# Altium schematic sheet Slave.SchDoc: Slave_subcircuit
size A4; DrawnBy: A.F
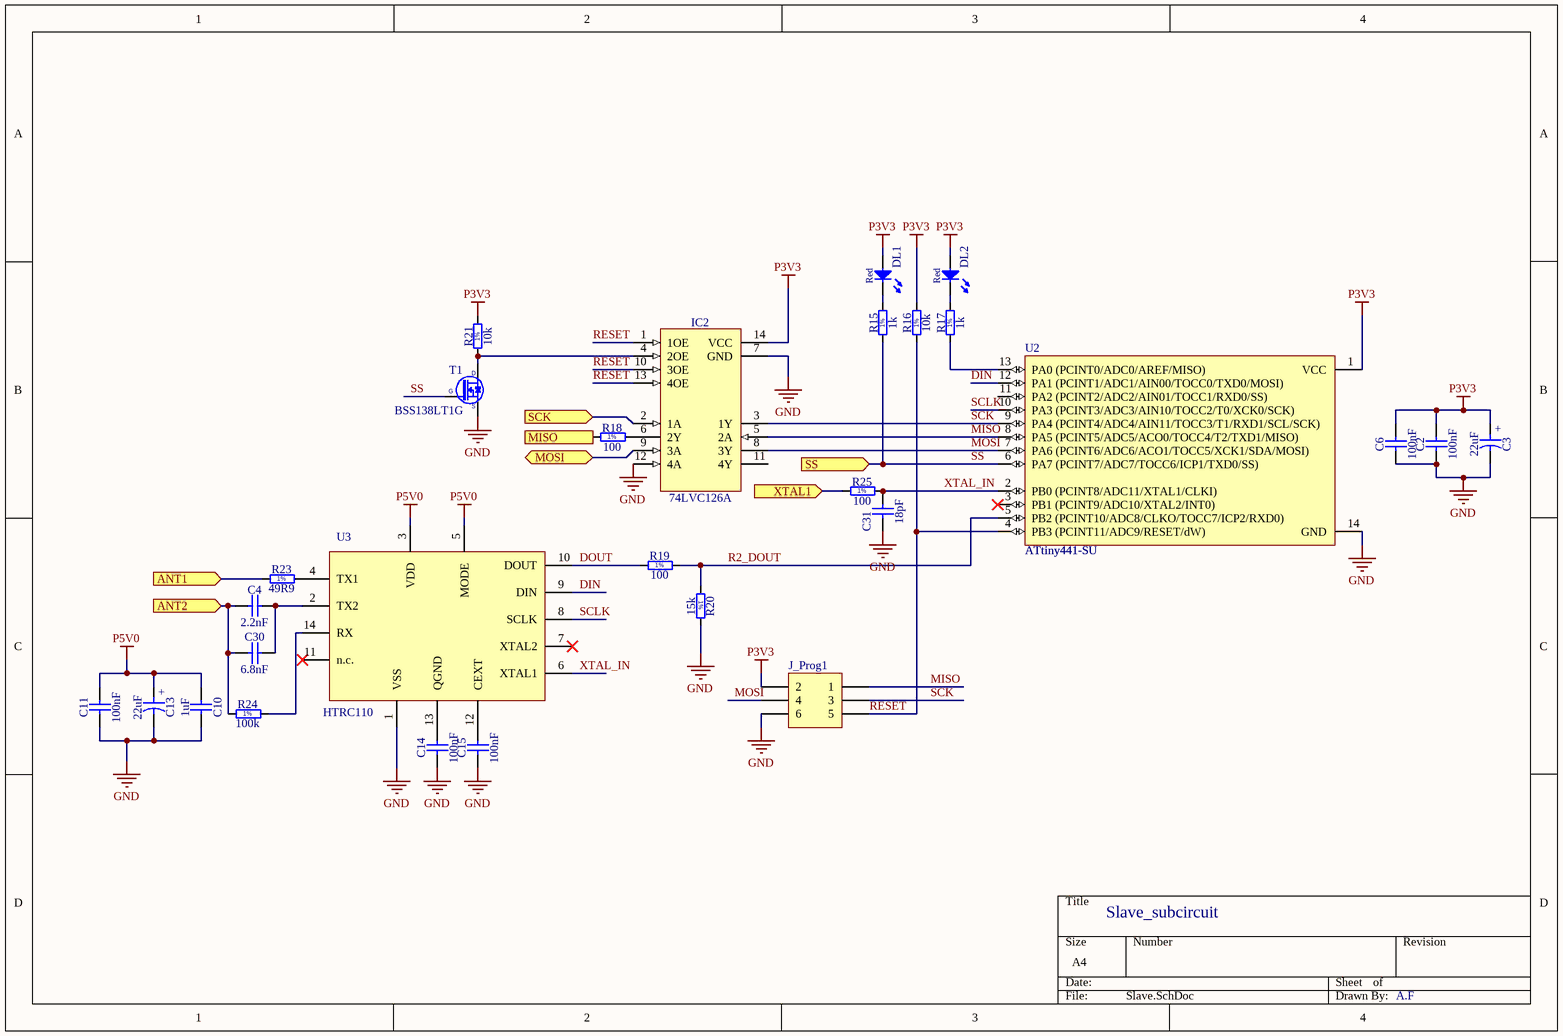
[diagram p0: Slave.SchDoc]

## Parts
C2  100nF  [CAPC1608X87N]
C3  22uF  [CAPAE430X540N]
C4  2.2nF  [CAPC1005X55N]
C6  100nF  [CAPC1608X87N]
C10  1uF  [CAPC1005X55N]
C11  100nF  [CAPC1608X87N]
C13  22uF  [CAPAE430X540N]
C14  100nF  [CAPC1608X87N]
C15  100nF  [CAPC1608X87N]
C30  6.8nF  [CAPC1005X55N]
C31  18pF  [CAPC1005X55N]
DL1  Red  [LED_OSRAM_LSR976]
DL2  Red  [LED_OSRAM_LSR976]
IC2  74LVC126A  [SOIC127P600X175-14N]
J_Prog1  (no value)  [HDR2X3]
R15  1k  [RESC1608X50N]
R16  10k  [RESC1608X50N]
R17  1k  [RESC1608X50N]
R18  100  [RESC1005X40N]
R19  100  [RESC1005X40N]
R20  15k  [RESC1608X50N]
R21  10k  [RESC1608X50N]
R23  49R9  [RESC6331X70N]
R24  100k  [RESC1005X40N]
R25  100  [RESC1005X40N]
T1  BSS138LT1G  [SOT95P240X110-3N]
U2  ATtiny441-SU  [14S1_L]
U3  HTRC110  [SOIC127P600X175-14N]

## Ports
ANT1 (in), ANT2 (in), MISO (out), MOSI (bidir), SCK (in), SS (in), XTAL1 (in)

## Nets
GND: C2.1 C3.2 C6.1 C10.2 C11.1 C13.2 C14.1 C15.1 C31.1 IC2.7(GND) IC2.12(4A) J_Prog1.6 R20.2 T1.2(S) U2.14(GND) U3.1(VSS)
P3V3: C2.2 C3.1 C6.2 DL1.2(A) DL2.2(A) IC2.14(VCC) J_Prog1.2 R16.2 R21.2 U2.1(VCC)
P5V0: C10.1 C11.2 C13.1 U3.3(VDD) U3.5(MODE)
ANT1: R23.1 ; port ANT1
ANT2: C4.1 C30.1 R24.1 ; port ANT2
DIN: U2.12(PA1_(PCINT1/ADC1/AIN00/TOCC0/TXD0/MOSI)) U3.9(DIN)
DOUT: R19.1 U3.10(DOUT)
MISO: IC2.5(2A) J_Prog1.1 U2.8(PA5_(PCINT5/ADC5/ACO0/TOCC4/T2/TXD1/MISO))
MISO: R18.1 ; port MISO  [a separate net that carries the same name]
MOSI: IC2.8(3Y) J_Prog1.4 U2.7(PA6_(PCINT6/ADC6/ACO1/TOCC5/XCK1/SDA/MOSI))
MOSI: IC2.9(3A) ; port MOSI  [a separate net that carries the same name]
R2_DOUT: R19.2 R20.1 U2.5(PB2_(PCINT10/ADC8/CLKO/TOCC7/ICP2/RXD0))
RESET: IC2.1(1OE) IC2.10(3OE) IC2.13(4OE) J_Prog1.5 R16.1 U2.4(PB3_(PCINT11/ADC9/RESET/dW))
SCK: IC2.3(1Y) J_Prog1.3 U2.9(PA4_(PCINT4/ADC4/AIN11/TOCC3/T1/RXD1/SCL/SCK))
SCK: IC2.2(1A) ; port SCK  [a separate net that carries the same name]
SCLK: U2.10(PA3_(PCINT3/ADC3/AIN10/TOCC2/T0/XCK0/SCK)) U3.8(SCLK)
SS: R15.1 T1.1(G) U2.6(PA7_(PCINT7/ADC7/TOCC6/ICP1/TXD0/SS)) ; port SS
XTAL1: R25.1 ; port XTAL1
XTAL_IN: C31.2 R25.2 U2.2(PB0_(PCINT8/ADC11/XTAL1/CLKI)) U3.6(XTAL1)
NetC4_2: C4.2 C30.2 U3.2(TX2)
NetC14_2: C14.2 U3.13(QGND)
NetC15_2: C15.2 U3.12(CEXT)
NetDL1_1: DL1.1(C) R15.2
NetDL2_1: DL2.1(C) R17.2
NetIC2_4: IC2.4(2OE) R21.1 T1.3(D)
NetIC2_6: IC2.6(2Y) R18.2
NetR17_1: R17.1 U2.13(PA0_(PCINT0/ADC0/AREF/MISO))
NetR23_2: R23.2 U3.4(TX1)
NetR24_2: R24.2 U3.14(RX)

Not connected (* = marked no-connect by the designer): IC2 11(4Y); U2 3(PB1_(PCINT9/ADC10/XTAL2/INT0))* 11(PA2_(PCINT2/ADC2/AIN01/TOCC1/RXD0/SS)); U3 7(XTAL2)* 11(n.c.)*

## Notes on the sheet
- (in symbol CAE430-540_22UF_10V_20%) +
- (in symbol R0402_100K_1%_0.0625W_100PPM) 1%
- (in symbol R0402_100R_1%_0.0625W_100PPM) 1%
- (in symbol R0603_10K_1%_0.1W_100PPM) 1%
- (in symbol R0603_15K_1%_0.1W_100PPM) 1%
- (in symbol R0805_1K_1%_0.33W_100PPM_VISHAY_CRCW-HP) 1%
- (in symbol R2512_49R9_1%_1W_100PPM_VISHAY_CRCW) 1%

## Library data of the parts
C2 C6 C14 C15 = CC0603_100NF_50V_10%_X5R: Non-polarised capacitor; Part Description: SMD Multilayer Chip Ceramic Capacitor; Manufacturer: GENERIC; Manufacturer1 Part Number: C1608X5R1H104K080AA; Voltage: 50V; TC: X5R; Tolerance: ±10%; Part Number: CC0603_100NF_50V_10%_X5R; Component Kind: Standard; Component Type: Standard; Pin Count: 2; Value: 100nF; Status: None; Manufacturer Part Number: CC0603_100NF_50V_10%_X5R; Case: 0603; Mounted: Yes; Socket: No; SMD: Yes; Sense: No; Manufacturer1 Example: TDK; Manufacturer1 ComponentHeight: 0.9mm; HelpURL: \\cern.ch\dfs\Applications\Altium\Datasheets\CC0603_X5R_TDK_C.pdf; Author: CERN DEM MR; CreateDate: 08.01.2016; LatestRevisionDate: 08.01.2016
C3 C13 = CAE430-540_22UF_10V_20%: Polarised capacitor; Part Description: Aluminum Electrolytic SMT Capacitor; Manufacturer: PANASONIC; Manufacturer Part Number: EEEFK1A220AR; Voltage: 10V; Tolerance: ±20%; Part Number: CAE430-540_22UF_10V_20%; Component Kind: Standard; Component Type: Standard; Pin Count: 2; Value: 22uF; Status: Not Recommended; Case: B; Mounted: Yes; Socket: No; SMD: Yes; Sense: No; ComponentHeight: 5.8mm; HelpURL: \\cern.ch\dfs\Applications\Altium\Datasheets\CAE_PANASONIC_FK.pdf; Author: CERN DEM JLC; CreateDate: 2007-12-03; LatestRevisionDate: 2014-11-05
C4 = CC0402_2.2NF_50V_10%_X7R: Non-polarised capacitor; Part Description: SMD Multilayer Chip Ceramic Capacitor; Manufacturer: GENERIC; Manufacturer1 Part Number: 223858715627; Voltage: 50V; TC: X7R; Tolerance: ±10%; Part Number: CC0402_2.2NF_50V_10%_X7R; Component Kind: Standard; Component Type: Standard; Pin Count: 2; Value: 2.2nF; Status: Not Recommended; Manufacturer Part Number: CC0402_2.2NF_50V_10%_X7R; Case: 0402; Mounted: Yes; Socket: No; SMD: Yes; Sense: No; Manufacturer1 Example: PHYCOMP; Manufacturer1 ComponentHeight: 0.55mm; HelpURL: \\cern.ch\dfs\Applications\Altium\Datasheets\CC0402_X7R_PHYCOMP.pdf; Author: CERN DEM JLC; CreateDate: 03.12.2007; LatestRevisionDate: 03.12.2007
C10 = CC0402_1UF_16V_10%_X5R: Non-polarised capacitor; Part Description: SMD Multilayer Chip Ceramic Capacitor; Manufacturer: GENERIC; Manufacturer1 Part Number: C1005X5R1C105KT; Voltage: 16V; TC: X5R; Tolerance: ±10%; Part Number: CC0402_1UF_16V_10%_X5R; Component Kind: Standard; Component Type: Standard; Pin Count: 2; Value: 1uF; Status: Preferred; Manufacturer Part Number: CC0402_1UF_16V_10%_X5R; Case: 0402; Mounted: Yes; Socket: No; SMD: Yes; Sense: No; Manufacturer1 Example: TDK; Manufacturer1 ComponentHeight: 0.55mm; HelpURL: \\cern.ch\dfs\Applications\Altium\Datasheets\CC0402_X5R_TDK_C.pdf; Author: CERN DEM JLC; CreateDate: 25.10.2012; LatestRevisionDate: 25.10.2012
C11 = CC0603_10NF_50V_10%_X7R: Non-polarised capacitor; Part Description: SMD Multilayer Chip Ceramic Capacitor; Manufacturer: GENERIC; Manufacturer1 Part Number: 223858615636; Value: 10nF; Voltage: 50V; TC: X7R; Tolerance: ±10%; Part Number: CC0603_10NF_50V_10%_X7R; Component Kind: Standard; Component Type: Standard; Pin Count: 2; Status: Preferred; Manufacturer Part Number: CC0603_10NF_50V_10%_X7R; Case: 0603; Mounted: Yes; Socket: No; SMD: Yes; Sense: No; Manufacturer1 Example: PHYCOMP; Manufacturer1 ComponentHeight: 0.87mm; HelpURL: \\cern.ch\dfs\Applications\Altium\Datasheets\CC0603_X7R_PHYCOMP.pdf; Author: CERN DEM JLC; CreateDate: 2007-12-03; LatestRevisionDate: 2007-12-03
C30 = CC0402_6.8NF_16V_10%_X7R: Non-polarised capacitor; Part Description: SMD Multilayer Chip Ceramic Capacitor; Manufacturer: GENERIC; Manufacturer1 Part Number: 223878715634; Voltage: 16V; TC: X7R; Tolerance: ±10%; Part Number: CC0402_6.8NF_16V_10%_X7R; Component Kind: Standard; Component Type: Standard; Pin Count: 2; Value: 6.8nF; Status: Not Recommended; Manufacturer Part Number: CC0402_6.8NF_16V_10%_X7R; Case: 0402; Mounted: Yes; Socket: No; SMD: Yes; Sense: No; Manufacturer1 Example: PHYCOMP; Manufacturer1 ComponentHeight: 0.55mm; HelpURL: \\cern.ch\dfs\Applications\Altium\Datasheets\CC0402_X7R_PHYCOMP.pdf; Author: CERN DEM JLC; CreateDate: 03.12.2007; LatestRevisionDate: 03.12.2007
C31 = CC0402_18PF_50V_5%_C0G: Non-polarised capacitor; Part Description: SMD Multilayer Chip Ceramic Capacitor; Manufacturer: GENERIC; Manufacturer1 Part Number: C0402C180J5GACTU; Voltage: 50V; TC: C0G/NP0; Tolerance: ±5%; Part Number: CC0402_18PF_50V_5%_C0G; Component Kind: Standard; Component Type: Standard; Pin Count: 2; Value: 18pF; Status: Preferred; Manufacturer Part Number: CC0402_18PF_50V_5%_C0G; Case: 0402; Mounted: Yes; Socket: No; SMD: Yes; Sense: No; Manufacturer1 Example: KEMET; Manufacturer1 ComponentHeight: 0.55mm; HelpURL: \\cern.ch\dfs\Applications\Altium\Datasheets\CC0805_C0G_KEMET_(Commercial Grade).pdf; Author: CERN DEM JLC; CreateDate: 04.10.2016; LatestRevisionDate: 04.10.2016
DL1 DL2 = LED_OSRAM_LSR976: LED Red 1C 2A; Part Description: Surface Mount Super Red LED (0805 Case); Manufacturer: OSRAM; Manufacturer Part Number: LSR976; PressFit: No; Bonding: No; Part Number: LED_OSRAM_LSR976; Component Kind: Standard; Component Type: Standard; Color: Red; PackageDescription: Super Red Chip LED, 2-Leads, Body 2 x1.25mm, IPC Medium Density; Pin Count: 2; Case: 0805; Mounted: Yes; Socket: No; SMD: Yes; Sense: No; ComponentHeight: 0.9mm; HelpURL: \\cern.ch\dfs\Applications\Altium\Datasheets\LED_OSRAM_LSR976.pdf; Author: CERN DEM JLC; CreateDate: 18.05.2010; LatestRevisionDate: 18.05.2010
IC2 = 74125: Quadruple Bus Buffer with 3-State Outputs; Manufacturer: TEXAS INSTRUMENTS; PressFit: No; Bonding: No; Part Number: 74LVC126A; Component Kind: Standard; Component Type: Standard; Device: 74LVC126A; PackageDescription: SOIC 14, Pitch 1.27mm - Body 4x8.75mm, IPC Medium Density; Part Description: Quadruple Bus Buffer with 3-State Outputs; Manufacturer Part Number: 74LVC126A; Pin Count: 14; Case: SOIC14; Mounted: Yes; Socket: No; SMD: Yes; Sense: No; ComponentHeight: 1.75mm; Author: CERN DEM JLC; HelpURL: \\cern.ch\dfs\Applications\Altium\Datasheets\SN74HC125D.pdf; CreateDate: 2011-06-30; LatestRevisionDate: 2011-06-30
J_Prog1 = Header 3X2: Header, 3-Pin, Dual row; LatestRevisionDate: 17-Jul-2002; LatestRevisionNote: Re-released for DXP Platform.; Publisher: Altium Limited
R15 R17 = R0805_1K_1%_0.33W_100PPM_VISHAY_CRCW-HP: Resistor - 1%; Part Description: 150V, Pulse Proof, High Power Thick Film Chip Resistor; Manufacturer: VISHAY DRALORIC; Manufacturer Part Number: CRCW08051K00FKEAHP; Power: 0.33W; TC: ±100ppm/°C; PressFit: No; Part Number: R0805_1K_1%_0.33W_100PPM_VISHAY_CRCW-HP; Component Kind: Standard; Component Type: Standard; Footprint: RESC2012X60N; Pin Count: 2; Value: 1k; Status: None; Tolerance: ±1%; Case: 0805; Mounted: Yes; Sense: No; Socket: No; SMD: Yes; Manufacturer1 ComponentHeight: 0.6mm; HelpURL: \\cern.ch\dfs\Applications\Altium\Datasheets\R0805_VISHAY_CRCW-HP e3.pdf; Author: CERN DEM JLC; CreateDate: 2010-06-16; LatestRevisionDate: 2010-06-16
R16 = R0805_1K_1%_0.33W_100PPM_VISHAY_CRCW-HP: Resistor - 1%; Part Description: 150V, Pulse Proof, High Power Thick Film Chip Resistor; Manufacturer: VISHAY DRALORIC; Manufacturer Part Number: CRCW08051K00FKEAHP; Value: 1k; Power: 0.33W; TC: ±100ppm/°C; PressFit: No; Part Number: R0805_1K_1%_0.33W_100PPM_VISHAY_CRCW-HP; Component Kind: Standard; Component Type: Standard; Footprint: RESC2012X60N; Pin Count: 2; Status: None; Tolerance: ±1%; Case: 0805; Mounted: Yes; Sense: No; Socket: No; SMD: Yes; Manufacturer1 ComponentHeight: 0.6mm; HelpURL: \\cern.ch\dfs\Applications\Altium\Datasheets\R0805_VISHAY_CRCW-HP e3.pdf; Author: CERN DEM JLC; CreateDate: 2010-06-16; LatestRevisionDate: 2010-06-16
R18 R19 R25 = R0402_100R_1%_0.0625W_100PPM: Resistor - 1%; Part Description: General Purpose Thick Film Chip Resistor; Manufacturer: GENERIC; Manufacturer1 Part Number: 232270671001L; TC: ±100ppm/°C; PressFit: No; Part Number: R0402_100R_1%_0.0625W_100PPM; Component Kind: Standard; Component Type: Standard; Pin Count: 2; Value: 100; Status: Not Recommended; Power: 0.0625W; Tolerance: ±1%; Manufacturer Part Number: R0402_100R_1%_0.0625W_100PPM; Case: 0402; Mounted: Yes; Sense: No; Socket: No; SMD: Yes; Manufacturer1 Example: YAGEO PHYCOMP; Manufacturer1 ComponentHeight: 0.4mm; HelpURL: \\cern.ch\dfs\Applications\Altium\Datasheets\R0402_Phycomp_RC0402.pdf; Author: CERN DEM JLC; CreateDate: 03.12.2007; LatestRevisionDate: 17.10.2012
R20 = R0603_15K_1%_0.1W_100PPM: Resistor - 1%; Part Description: General Purpose Thick Film Chip Resistor; Manufacturer: GENERIC; Manufacturer1 Part Number: NRC06F1502TRF; Power: 0.1W; TC: ±100ppm/°C; PressFit: No; Part Number: R0603_15K_1%_0.1W_100PPM; Component Kind: Standard; Component Type: Standard; Footprint: RESC1608X55N; Pin Count: 2; Value: 15k; Status: Preferred; Tolerance: ±1%; Manufacturer Part Number: R0603_15K_1%_0.1W_100PPM; Case: 0603; Mounted: Yes; Sense: No; Socket: No; SMD: Yes; Manufacturer1 Example: NIC COMPONENT; Manufacturer1 ComponentHeight: 0.55mm; HelpURL: \\cern.ch\dfs\Applications\Altium\Datasheets\R0603_NIC_NRC.pdf; Author: CERN DEM JMW; CreateDate: 2015-08-17; LatestRevisionDate: 2015-08-17
R21 = R0603_10K_1%_0.1W_100PPM: Resistor - 1%; Part Description: General Purpose Thick Film Chip Resistor; Manufacturer: GENERIC; Manufacturer1 Part Number: NRC06F1002TRF; Power: 0.1W; TC: ±100ppm/°C; PressFit: No; Part Number: R0603_10K_1%_0.1W_100PPM; Component Kind: Standard; Component Type: Standard; Footprint: RESC1608X55N; Pin Count: 2; Value: 10k; Status: Preferred; Tolerance: ±1%; Manufacturer Part Number: R0603_10K_1%_0.1W_100PPM; Case: 0603; Mounted: Yes; Sense: No; Socket: No; SMD: Yes; Manufacturer1 Example: NIC COMPONENT; Manufacturer1 ComponentHeight: 0.55mm; HelpURL: \\cern.ch\dfs\Applications\Altium\Datasheets\R0603_NIC_NRC.pdf; Author: CERN DEM JLC; CreateDate: 2007-12-03; LatestRevisionDate: 2008-03-13
R23 = R2512_49R9_1%_1W_100PPM_VISHAY_CRCW: Resistor - 1%; Part Description: Thick Film Chip Resistor; Manufacturer: VISHAY DRALORIC; Manufacturer Part Number: CRCW251249R9FKEG; Power: 1W; TC: ±100ppm/°C; PressFit: No; Part Number: R2512_49R9_1%_1W_100PPM_VISHAY_CRCW; Component Kind: Standard; Component Type: Standard; Pin Count: 2; Value: 49R9; Status: None; Tolerance: ±1%; Case: 2512; Mounted: Yes; Sense: No; Socket: No; SMD: Yes; HelpURL: \\cern.ch\dfs\Applications\Altium\Datasheets\R2512_VISHAY_CRCW2512.pdf; Author: CERN DEM JLC; CreateDate: 22.05.2012; LatestRevisionDate: 22.05.2012; ComponentHeight: 0.7mm
R24 = R0402_100K_1%_0.0625W_100PPM: Resistor - 1%; Part Description: General Purpose Thick Film Chip Resistor; Manufacturer: GENERIC; Manufacturer1 Part Number: 232270671004L; TC: ±100ppm/°C; PressFit: No; Part Number: R0402_100K_1%_0.0625W_100PPM; Component Kind: Standard; Component Type: Standard; Pin Count: 2; Value: 100k; Status: Not Recommended; Power: 0.0625W; Tolerance: ±1%; Manufacturer Part Number: R0402_100K_1%_0.0625W_100PPM; Case: 0402; Mounted: Yes; Sense: No; Socket: No; SMD: Yes; Manufacturer1 Example: YAGEO PHYCOMP; Manufacturer1 ComponentHeight: 0.4mm; HelpURL: \\cern.ch\dfs\Applications\Altium\Datasheets\R0402_Phycomp_RC0402.pdf; Author: CERN DEM JLC; CreateDate: 03.12.2007; LatestRevisionDate: 17.10.2012
T1 = BSS138LT1G: N-CHANNEL MOSFET WITH DIODE; Part Description: 50V 200mA N-Channel Enhancement Mode Field-Effect Transistor; Manufacturer: ON SEMICONDUCTOR; PressFit: No; Bonding: No; Part Number: BSS138LT1G; Component Kind: Standard; Component Type: Standard; Device: BSS138LT1G; PackageDescription: SOT23 3-Leads, Pitch 0.95mm - Body 1.4x3mm, IPC Medium Density; Manufacturer Part Number: BSS138LT1G; Pin Count: 3; Case: SOT23-3; Mounted: Yes; Socket: No; SMD: Yes; Sense: No; ComponentHeight: 1.11mm; HelpURL: \\cern.ch\dfs\Applications\Altium\Datasheets\BSS138LT1G.pdf; Author: CERN DEM JLC; CreateDate: 23.03.2009; LatestRevisionDate: 23.03.2009
U2 = ATtiny441-SU: 8-bit AVR Microcontroller, 1.8-5.5V, 2KB Flash, 128 Bytes SRAM, 12 GPIO pins, 14-pin SOIC, Industrial Grade (-40°C to 85°C), Pb-Free; Published: 1-Apr-2010; DatasheetVersion: revA, Mar-2010; PackageVersion: revA, Feb-2002; PackageReference: 14S1; Publisher: Altium Limited; PackageDescription: 14-Lead, 0.150” Wide Body, Plastic Gull Wing Small Outline Package (SOIC); Code_JEDEC: MS-012-AB; Code_IPC: SOIC127P600-14; ComponentLink1Description: ATtiny20 Datasheet; ComponentLink1URL: http://www.atmel.com/dyn/resources/prod_documents/doc8235.pdf; ComponentLink2Description: ATtiny20 Summary; ComponentLink2URL: http://www.atmel.com/dyn/resources/prod_documents/8235S.pdf; ComponentLink3Description: Atmel.com Home; ComponentLink3URL: http://www.atmel.com; Supplier 1: Digi-Key; Supplier Part Number 1: 1611-ATTINY44-15SSZCT-ND; Name: ATtiny441-SU
U3 = HTRC110: HITAG reader chip